# Altium schematic sheet 555_SCHEMATIC.SchDoc
size A4
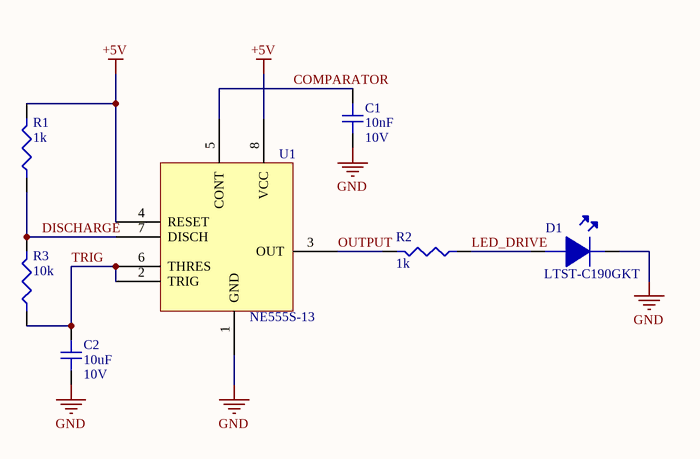
[diagram p0: 555_SCHEMATIC.SchDoc]

## Parts
C1  10nF  Voltage Rating: 10V  [C0603]
C2  10uF  Voltage: 10V  [C0603]
D1  LTST-C190GKT  [LED_0603]
R1  1k  [R0603]
R2  1k  [R0603]
R3  10k  [R0603]
U1  NE555S-13  [SOIC-8]

## Nets
+5V: R1.2 U1.4(RESET) U1.8(VCC)
GND: C1.1 C2.1 D1.2 U1.1(GND)
COMPARATOR: C1.2 U1.5(CONT)
DISCHARGE: R1.1 R3.2 U1.7(DISCH)
LED_DRIVE: D1.1 R2.1
OUTPUT: R2.2 U1.3(OUT)
TRIG: C2.2 R3.1 U1.2(TRIG) U1.6(THRES)

## Library data of the parts
C1 = CC0603KRX7R6BB103: Cap Ceramic 0.01uF 10V X7R 10% SMD 0603 125C Paper T/R; Manufacturer: Yageo; Supplier 1: Mouser; Manufacturer Part Number: CC0603KRX7R6BB103; Stock 1: 1987; Pricing 1: 1=0.1, 10=0.039, 50=0.039, 100=0.018, 1000=0.014, 10000=0.01 (USD); Mount: Surface Mount; Case/Package: 0603; Min Operating Temperature: -55°C; Max Operating Temperature: 125°C; Capacitance: 10nF; Voltage Rating (DC): 10V; Tolerance: 10%; Packaging: Tape and Reel; Dielectric: X7R; Composition: Ceramic; Length: 0.063inch; Height: 0.8mm; Width: 0.031inch; Thickness: 0.035inch; Depth: 0.8mm; Radiation Hardening: No; Lead Free: Lead Free; Halogen Free: Halogen Free; Supplier Part Number 1: 603-CC603KRX7R6BB103
C2 = GRM188R61A106KE69D: Cap Ceramic 10uF 10V X5R 10% SMD 0603 85C Paper T/R; Manufacturer: Murata; Supplier 1: Mouser; Manufacturer Part Number: GRM188R61A106KE69D; Stock 1: 0; Pricing 1: 1=0.19, 10=0.131, 50=0.131, 100=0.066, 1000=0.04, 10000=0.029 (USD); Mount: Surface Mount; Case/Package: 0603; Case Code (Metric): 1608; Case Code (Imperial): 0603; Min Operating Temperature: -55°C; Max Operating Temperature: 85°C; Capacitance: 10uF; Tolerance: 10%; Packaging: Tape and Reel; Dielectric: X5R; Voltage Rating: 10V; Voltage Rating (DC): 10V; Length: 1.6mm; Height: 0.8mm; Width: 0.031inch; Thickness: 0.037inch; Depth: 0.8mm; REACH SVHC: No SVHC; Lead Free: Lead Free; Supplier Part Number 1: 81-GRM188R61A106KE9D
D1 = LTST-C190GKT: LED GREEN CLEAR 0603 SMD; Manufacturer: Vishay Lite-On; Lens Colour: Clear,Colorless; Luminous Intensity: 6mcd; Forward Voltage: 2.1V; Viewing Angle: 130°; Lens Style: Clear,Colorless,Diffused,Rectangular; Forward Current: 30mA; Power Rating: 100mW; Dominant Wavelength: 569nm; Test Current: 10mA; Number of Elements: 1; Wavelength: 565nm; Voltage: 2V; Reverse Voltage: 5V; Current: 1A; Supplier 1: Digi-Key; Manufacturer Part Number: LTST-C190GKT; Stock 1: 1795364; Pricing 1: 1=0.27, 10=0.196, 25=0.1448, 100=0.1034, 250=0.07032, 500=0.06204, 1000=0.0486 (USD); Mount: Surface Mount; Case/Package: 0603; Number of Pins: 2; Colour: Green; Case Code (Metric): 1608; Case Code (Imperial): 0603; Min Operating Temperature: -55°C; Max Operating Temperature: 85°C; Package Quantity: 1; Packaging: Tape and Reel; Illumination Colour: Green; Lens Transparency: Clear; Power Dissipation: 100mW; Number of LEDs: 1; Length: 1.6mm; Height: 0.8mm; Width: 0.8mm; Depth: 0.8mm; Radiation Hardening: No; Lead Free: Lead Free; Supplier Part Number 1: 160-1183-6-ND
R1 R2 = ESR03EZPJ102: RES SMD 1K OHM 5% 1/4W 0603; Manufacturer: Rohm; Resistance: 1kR; Temperature Coefficient: 200ppm/°C; Max Power Dissipation: 250mW; Supplier 1: Future Electronics; Manufacturer Part Number: ESR03EZPJ102; Stock 1: 0; Pricing 1: 1=0.022, 250=0.0157, 750=0.0138, 1500=0.0122, 2500=0.011 (USD); Case/Package: 0603; Case Code (Metric): 1608; Case Code (Imperial): 0603; Min Operating Temperature: -55°C; Max Operating Temperature: 155°C; Tolerance: 5%; Package Quantity: 1; Packaging: Tape and Reel; Composition: Thick Film; Number of Terminations: 2; Features: Automotive AEC-Q200; Length: 0.063inch; Height: 0.022inch; Width: 0.031inch; Lead Free: Lead Free; Supplier Part Number 1: 2103938
R3 = RR0816P-103-D: RES SMD 10K OHM 0.5% 1/16W 0816; Manufacturer: Susumu; Resistance: 10kR; Power Rating: 63mW; Voltage Rating: 75V; Temperature Coefficient: 25ppm/°C; Supplier 1: Arrow; Manufacturer Part Number: RR0816P-103-D; Stock 1: 7768; Pricing 1: 1=0.09, 10=0.045, 25=0.0405, 100=0.0198, 250=0.0178, 500=0.016 (USD); Case/Package: 0603; Number of Pins: 2; Weight: 7.1E-05oz; Case Code (Imperial): 0603; Case Code (Metric): 1608; Min Operating Temperature: -55°C; Max Operating Temperature: 125°C; Packaging: Tape and Reel; Tolerance: 0.5%; Package Quantity: 1; Termination: SMD/SMT; Composition: Thin Film; Number of Terminations: 2; Max Power Dissipation: 63mW; Voltage Rating (DC): 75V; Length: 1.6mm; Height: 0.4mm; Width: 0.8mm; Depth: 0.8mm; REACH SVHC: Unknown; Lead Free: Lead Free; Supplier Part Number 1: RR0816P-103-D
U1 = NE555S-13: 555 Type, Timer/Oscillator (Single) IC 500kHz 8-SOIC (0.154", 3.90mm Width); Manufacturer: Diodes; Max Supply Voltage: 16V; Min Supply Voltage: 4.5V; Operating Supply Current: 13mA; High Level Output Current: -200mA; Low Level Output Current: 200mA; Quiescent Current: 15mA; Number of Timers/Counters: 1; Supplier 1: Digi-Key; Manufacturer Part Number: NE555S-13; Stock 1: 2624; Pricing 1: 1=0.37, 10=0.303, 100=0.206, 500=0.15452, 1000=0.11588 (USD); Mount: Surface Mount; Case/Package: SO; Number of Pins: 8; Weight: 0.01787oz; Contact Plating: Tin,Matte; Min Operating Temperature: 0°C; Max Operating Temperature: 70°C; Packaging: Tape and Reel; Package Quantity: 2500; Frequency: 500kHz; Length: 4.95mm; Height: 1.5mm; Width: 3.95mm; Radiation Hardening: No; Lead Free: Lead Free; REACH SVHC: No SVHC; ComponentLink1URL: https://datasheet.ciiva.com/1232/ne555-sa555-na555-1232519.pdf; ComponentLink1Description: https://datasheet.ciiva.com/1232/ne555-sa555-na555-1232519.pdf; ComponentLink2URL: https://datasheet.ciiva.com/1232/ne555-sa555-na555-1232520.pdf; ComponentLink2Description: https://datasheet.ciiva.com/1232/ne555-sa555-na555-1232520.pdf; ComponentLink3URL: https://datasheet.ciiva.com/1232/ne555-sa555-na555-1232521.pdf; ComponentLink3Description: https://datasheet.ciiva.com/1232/ne555-sa555-na555-1232521.pdf; Supplier Part Number 1: NE555S-13DIDKR-ND